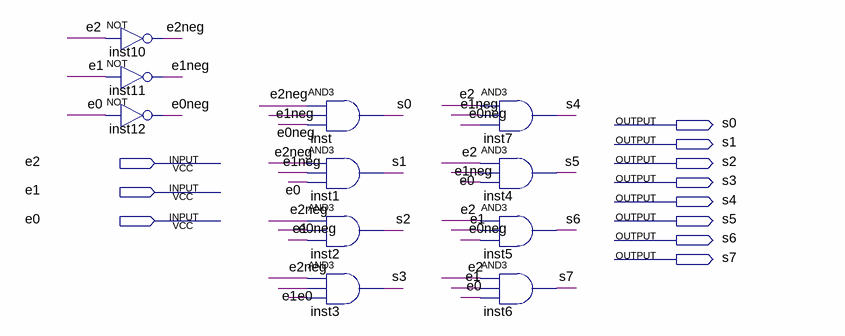
[diagram p0: schematic sheet]
// Quartus schematic decod3x8.bdf as structural Verilog: 11 symbols, 11 pins
module decod3x8 (
  input  e2,
  input  e1,
  input  e0,
  output s0,
  output s1,
  output s2,
  output s3,
  output s4,
  output s5,
  output s6,
  output s7
);

  wire e0neg, e1neg, e2neg;

  not inst10 (e2neg, e2);
  not inst11 (e1neg, e1);
  not inst12 (e0neg, e0);
  and inst (s0, e2neg, e1neg, e0neg);
  and inst1 (s1, e2neg, e1neg, e0);
  and inst2 (s2, e2neg, e1, e0neg);
  and inst3 (s3, e2neg, e1, e0);
  and inst7 (s4, e2, e1neg, e0neg);
  and inst4 (s5, e2, e1neg, e0);
  and inst5 (s6, e2, e1, e0neg);
  and inst6 (s7, e2, e1, e0);
endmodule
